# Altium project MaxiSCT-LB.PrjPcb
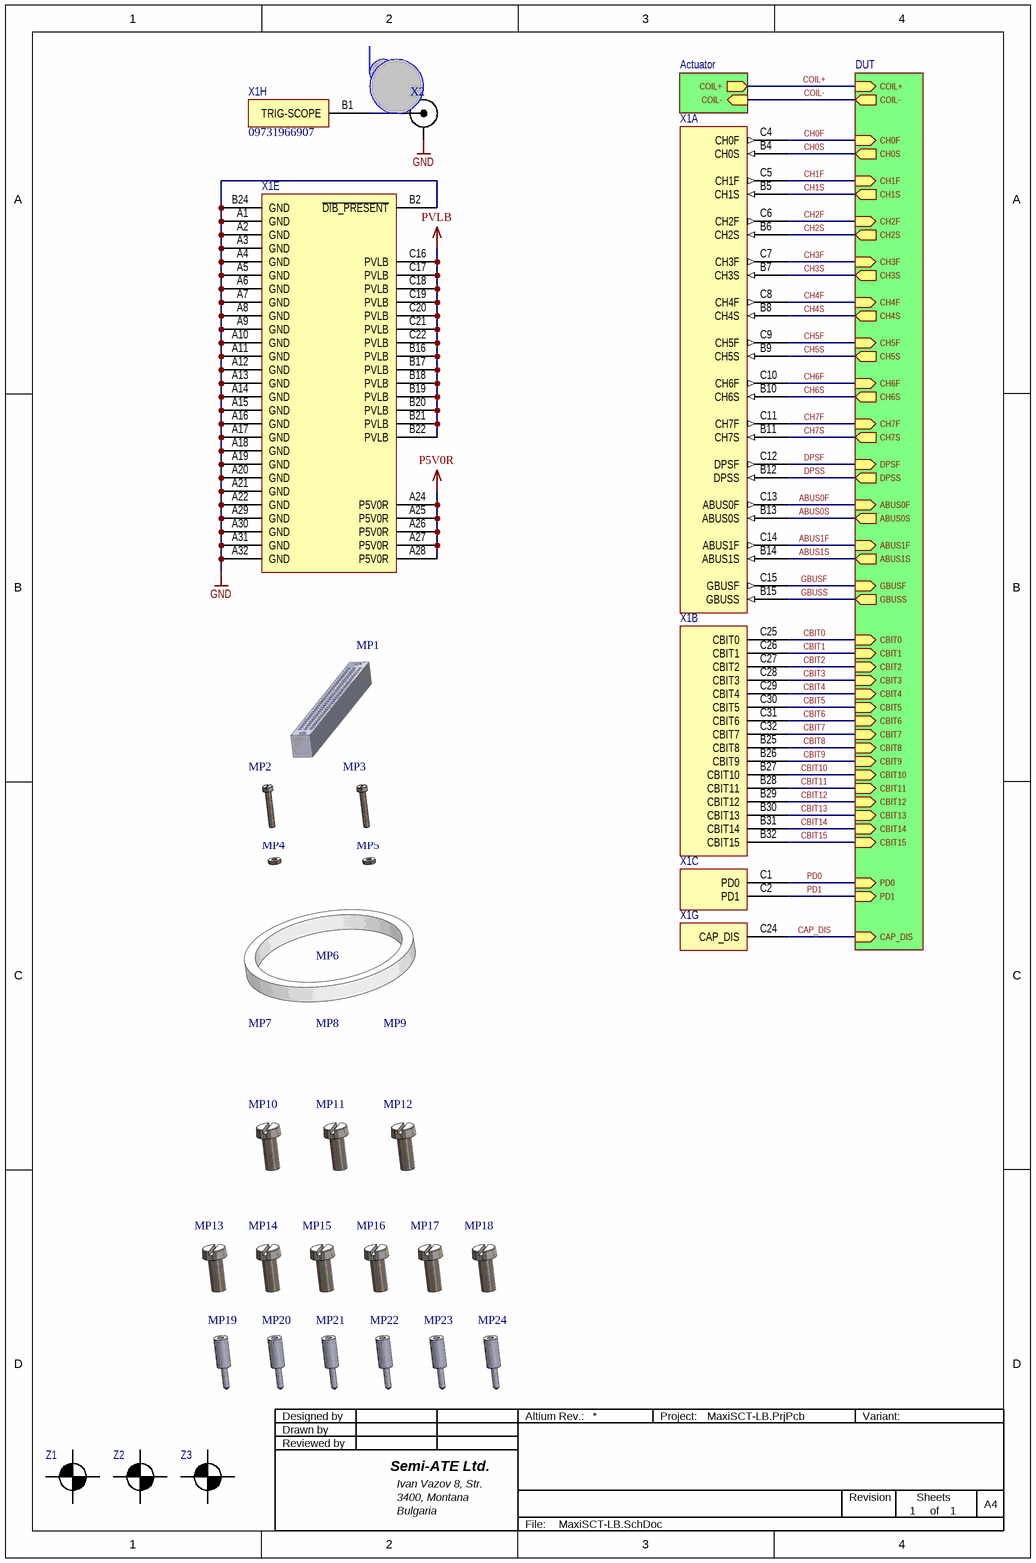
[diagram p0: MaxiSCT-LB.SchDoc]
Project_Revision: =MajorRevision+'.'+MinorRevision
1 sheet, 29 parts. Net scope: hierarchical (ports join the sheet entries above them; power ports are global).
Board file: MaxiSCT-LB.PcbDoc

## Sheet MaxiSCT-LB.SchDoc: Title-Name
size A4 portrait; Organization: Test-Engineering; Address1: Hans-Bunte-Strasse 19; Address2: D-79108 Freiburg; Address3: Germany; DocumentNumber: Document Nr.; SheetNumber: 1; SheetTotal: 1; Date: Date Engineer; CheckedBy: Reviewer; CompanyName: TDK-Micronas GmbH; DrawnBy: Draftsman; Engineer: Engineer; PageSetup: Record=PageOptions|CenterHorizontal=True|CenterVertical=True|PrintScale=0.97|XCorrection=1.00|YCorrection=1.00|PrintKind=0|BorderSize=5000000|LeftOffset=0|BottomOffset=0|Orientation=2|PaperLength=1000|PaperWidth=1000|Scale=100|PaperSource=7|PrintQuality=-3|MediaType=1|DitherType=10|PrintScaleMode=1|PaperKind=A4|PaperIndex=9

### Parts
MP1  DIN41612 Spacer MiniSCT LB  [DIN41612 Spacer MiniSCT LB]  (value not drawn)
MP2  ISO1207 - M2.5x16  [ISO1207 M2.5x16]  (value not drawn)
MP3  ISO1207 - M2.5x16  [ISO1207 M2.5x16]  (value not drawn)
MP4  ISO4035 - M2.5  [ISO4035 - M2.5]  (value not drawn)
MP5  ISO4035 - M2.5  [ISO4035 - M2.5]  (value not drawn)
MP6  Thermostream Ring  [Thermo Stream Ring]  (value not drawn)
MP7  Thermostream Dowel  [Thermo Dowel]  (value not drawn)
MP8  Thermostream Dowel  [Thermo Dowel]  (value not drawn)
MP9  Thermostream Dowel  [Thermo Dowel]  (value not drawn)
MP10  ISO1207 - M4x10  [ISO1207 M4x10]  (value not drawn)
MP11  ISO1207 - M4x10  [ISO1207 M4x10]  (value not drawn)
MP12  ISO1207 - M4x10  [ISO1207 M4x10]  (value not drawn)
MP13  ISO1207 - M4x10  [ISO1207 M4x10]  (value not drawn)
MP14  ISO1207 - M4x10  [ISO1207 M4x10]  (value not drawn)
MP15  ISO1207 - M4x10  [ISO1207 M4x10]  (value not drawn)
MP16  ISO1207 - M4x10  [ISO1207 M4x10]  (value not drawn)
MP17  ISO1207 - M4x10  [ISO1207 M4x10]  (value not drawn)
MP18  ISO1207 - M4x10  [ISO1207 M4x10]  (value not drawn)
MP19  MiniSCT LB StandOff  [MiniSCT LB StandOff]  (value not drawn)
MP20  MiniSCT LB StandOff  [MiniSCT LB StandOff]  (value not drawn)
MP21  MiniSCT LB StandOff  [MiniSCT LB StandOff]  (value not drawn)
MP22  MiniSCT LB StandOff  [MiniSCT LB StandOff]  (value not drawn)
MP23  MiniSCT LB StandOff  [MiniSCT LB StandOff]  (value not drawn)
MP24  MiniSCT LB StandOff  [MiniSCT LB StandOff]  (value not drawn)
X1  09731966907  [09731966907]  (value not drawn)  (parts A,B,C,E,G,H of 8)
X2  112778  [112778]  (value not drawn)
Z1  Fiducial  [Fiducial Cross]  (value not drawn)  (no BOM)
Z2  Fiducial  [Fiducial Point]  (value not drawn)  (no BOM)
Z3  Fiducial  [Fiducial Cross]  (value not drawn)  (no BOM)

### Sub-sheets
Actuator = EEPROM_and_Actuator.SchDoc (file not in this document): COIL+ (out), COIL- (in)
DUT = MiniSCT-LB-DUT.SchDoc (file not in this document): CH0F (in), CH1F (in), CH2F (in), CH3F (in), CH4F (in), CH5F (in), CH6F (in), CH7F (in), CH0S (out), CH1S (out), CH2S (out), CH3S (out), CH4S (out), CH5S (out), CH6S (out), CH7S (out), COIL+ (in), COIL- (out), CBIT0 (in), CBIT1 (in), CBIT2 (in), CBIT3 (in), CBIT4 (in), CBIT5 (in), CBIT6 (in), CBIT7 (in), CBIT8 (in), CBIT9 (in), CBIT10 (in), CBIT11 (in), CBIT12 (in), CBIT13 (in), CBIT14 (in), CBIT15 (in), ABUS0F (in), ABUS1F (in), ABUS0S (out), ABUS1S (out), GBUSF (in), GBUSS (out), DPSF (in), DPSS (out), PD0 (in), PD1 (in), CAP_DIS (in)

### Nets
GND: X1.A1(GND) X1.A2(GND) X1.A3(GND) X1.A4(GND) X1.A5(GND) X1.A6(GND) X1.A7(GND) X1.A8(GND) X1.A9(GND) X1.A10(GND) X1.A11(GND) X1.A12(GND) X1.A13(GND) X1.A14(GND) X1.A15(GND) X1.A16(GND) X1.A17(GND) X1.A18(GND) X1.A19(GND) X1.A20(GND) X1.A21(GND) X1.A22(GND) X1.A29(GND) X1.A30(GND) X1.A31(GND) X1.A32(GND) X1.B2(~{DIB_PRESENT}) X1.B24(GND) X2.0(Shield)
P5V0R: X1.A24(P5V0R) X1.A25(P5V0R) X1.A26(P5V0R) X1.A27(P5V0R) X1.A28(P5V0R)
PVLB: X1.B16(PVLB) X1.B17(PVLB) X1.B18(PVLB) X1.B19(PVLB) X1.B20(PVLB) X1.B21(PVLB) X1.B22(PVLB) X1.C16(PVLB) X1.C17(PVLB) X1.C18(PVLB) X1.C19(PVLB) X1.C20(PVLB) X1.C21(PVLB) X1.C22(PVLB)
ABUS0F: X1.C13(ABUS0F) ; sheet DUT/ABUS0F
ABUS0S: X1.B13(ABUS0S) ; sheet DUT/ABUS0S
ABUS1F: X1.C14(ABUS1F) ; sheet DUT/ABUS1F
ABUS1S: X1.B14(ABUS1S) ; sheet DUT/ABUS1S
CAP_DIS: X1.C24(CAP_DIS) ; sheet DUT/CAP_DIS
CBIT0: X1.C25(CBIT0) ; sheet DUT/CBIT0
CBIT1: X1.C26(CBIT1) ; sheet DUT/CBIT1
CBIT2: X1.C27(CBIT2) ; sheet DUT/CBIT2
CBIT3: X1.C28(CBIT3) ; sheet DUT/CBIT3
CBIT4: X1.C29(CBIT4) ; sheet DUT/CBIT4
CBIT5: X1.C30(CBIT5) ; sheet DUT/CBIT5
CBIT6: X1.C31(CBIT6) ; sheet DUT/CBIT6
CBIT7: X1.C32(CBIT7) ; sheet DUT/CBIT7
CBIT8: X1.B25(CBIT8) ; sheet DUT/CBIT8
CBIT9: X1.B26(CBIT9) ; sheet DUT/CBIT9
CBIT10: X1.B27(CBIT10) ; sheet DUT/CBIT10
CBIT11: X1.B28(CBIT11) ; sheet DUT/CBIT11
CBIT12: X1.B29(CBIT12) ; sheet DUT/CBIT12
CBIT13: X1.B30(CBIT13) ; sheet DUT/CBIT13
CBIT14: X1.B31(CBIT14) ; sheet DUT/CBIT14
CBIT15: X1.B32(CBIT15) ; sheet DUT/CBIT15
CH0F: X1.C4(CH0F) ; sheet DUT/CH0F
CH0S: X1.B4(CH0S) ; sheet DUT/CH0S
CH1F: X1.C5(CH1F) ; sheet DUT/CH1F
CH1S: X1.B5(CH1S) ; sheet DUT/CH1S
CH2F: X1.C6(CH2F) ; sheet DUT/CH2F
CH2S: X1.B6(CH2S) ; sheet DUT/CH2S
CH3F: X1.C7(CH3F) ; sheet DUT/CH3F
CH3S: X1.B7(CH3S) ; sheet DUT/CH3S
CH4F: X1.C8(CH4F) ; sheet DUT/CH4F
CH4S: X1.B8(CH4S) ; sheet DUT/CH4S
CH5F: X1.C9(CH5F) ; sheet DUT/CH5F
CH5S: X1.B9(CH5S) ; sheet DUT/CH5S
CH6F: X1.C10(CH6F) ; sheet DUT/CH6F
CH6S: X1.B10(CH6S) ; sheet DUT/CH6S
CH7F: X1.C11(CH7F) ; sheet DUT/CH7F
CH7S: X1.B11(CH7S) ; sheet DUT/CH7S
COIL+: sheet DUT/COIL+, sheet Actuator/COIL+
COIL-: sheet DUT/COIL-, sheet Actuator/COIL-
DPSF: X1.C12(DPSF) ; sheet DUT/DPSF
DPSS: X1.B12(DPSS) ; sheet DUT/DPSS
GBUSF: X1.C15(GBUSF) ; sheet DUT/GBUSF
GBUSS: X1.B15(GBUSS) ; sheet DUT/GBUSS
PD0: X1.C1(PD0) ; sheet DUT/PD0
PD1: X1.C2(PD1) ; sheet DUT/PD1
NetX1_B1: X1.B1(TRIG-SCOPE) X2.1(Signal)

### Notes on the sheet
- Designed by
- Reviewed by
- Drawn by
- Semi-ATE Ltd.
- Altium Rev.:
- Project:
- Variant:
- Bulgaria
- 3400, Montana
- Ivan Vazov 8, Str.
- File:
- Revision
- Sheets
- of
- A4

### Library data of the parts
MP1 = DIN41612 Spacer MiniSCT LB: DIN41612 Spacer LoadBoard side of a MiniSCT
MP2 MP3 = ISO1207 - M2.5x16: Slotted Cheese Head Screw M2.5x16
MP4 MP5 = ISO4035 - M2.5: Hex Thin Nut Chamfered grade AB M2.5
MP10-MP18 = ISO1207 - M4x10: Slotted Cheese Head Screw M4x10
MP19-MP24 = MiniSCT LB StandOff: MiniSCT LoadBoard StandOff
X1 = MiniSCT8: 96 Position Din Connector Header, Male Pins Gold or Gold-Palladium Through Hole; Manufacturer: Harting; Manufacturer Part Number: 09731966907; ComponentLink1Description: Datasheet; ComponentLink1URL: https://b2b.harting.com/files/download/PRD/PDF_DS/09731100001_100560208DRW001D.pdf; ComponentLink2Description: Reference; ComponentLink2URL: https://www.digikey.de/products/en?keywords=09731966907; Supplier 1: Digi-Key; Supplier Part Number 1: 1195-5217-ND
X2 = CON_TH_2_F_90_BNC: CONN BNC JACK R/A 75 OHM PCB; Manufacturer: Amphenol RF; Manufacturer Part Number: 112778; Supplier 1: Digi-Key; Supplier Part Number 1: ACX1985-ND; ComponentLink1Description: DataSheet; ComponentLink1URL: https://s3-us-west-2.amazonaws.com/catsy.582/112778.pdf; ComponentLink2Description: Reference; ComponentLink2URL: https://www.digikey.de/product-detail/en/amphenol-rf/112778/ACX1985-ND/3088370
Z1-Z3 = Fiducial: Assembly AOI